# Altium schematic sheet Top_level.SchDoc
size A4
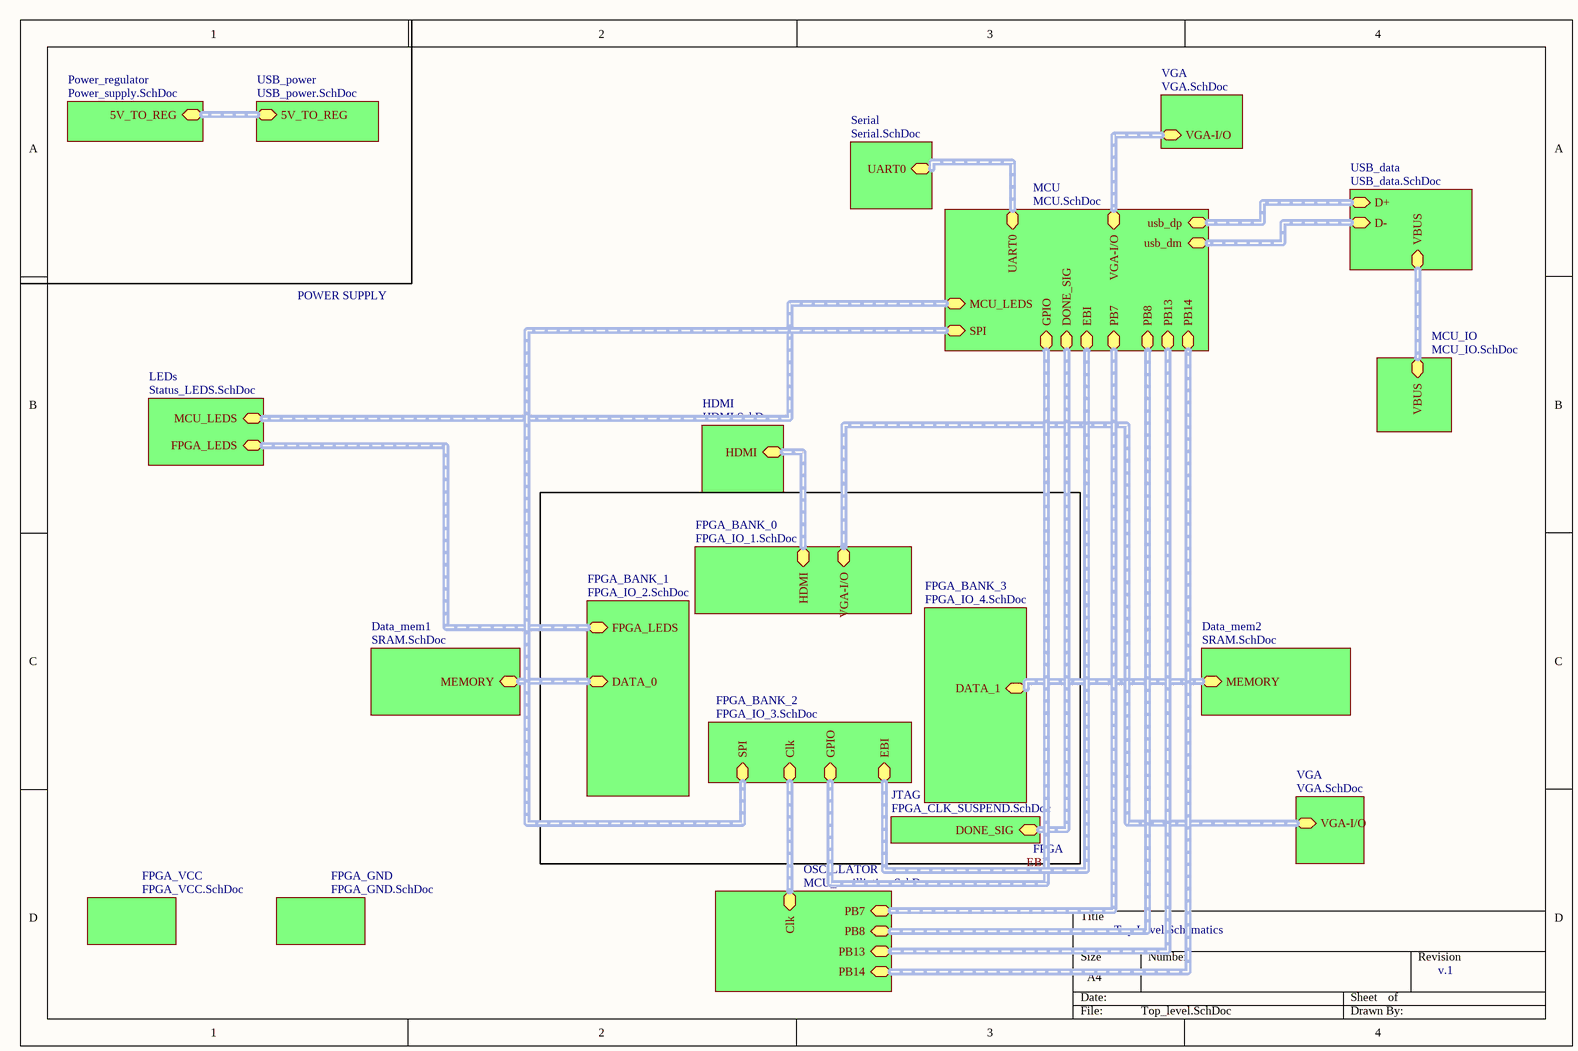
[diagram p0: Top_level.SchDoc]

## Sub-sheets
Data_mem1 = SRAM.SchDoc: MEMORY (harness MEMORY)
Data_mem2 = SRAM.SchDoc: MEMORY (harness MEMORY)
FPGA_BANK_0 = FPGA_IO_1.SchDoc: HDMI (harness HDMI), VGA-I/O (harness VGA-I/O)
FPGA_BANK_1 = FPGA_IO_2.SchDoc: DATA_0 (harness MEMORY), FPGA_LEDS (harness FPGA_LEDS)
FPGA_BANK_2 = FPGA_IO_3.SchDoc: EBI (harness EBI), SPI (harness SPI), Clk (harness FPGA-CLK), GPIO (harness GPIO)
FPGA_BANK_3 = FPGA_IO_4.SchDoc: DATA_1 (harness MEMORY)
FPGA_GND = FPGA_GND.SchDoc: no entries
FPGA_VCC = FPGA_VCC.SchDoc: no entries
HDMI = HDMI.SchDoc: HDMI (harness HDMI)
JTAG = FPGA_CLK_SUSPEND.SchDoc: DONE_SIG (harness DONE_SGN)
LEDs = Status_LEDS.SchDoc: MCU_LEDS (harness MCU_LEDS), FPGA_LEDS (harness FPGA_LEDS)
MCU = MCU.SchDoc: EBI (harness EBI), usb_dp (harness D+), VGA-I/O (harness VGA-I/O), usb_dm (harness D-), MCU_LEDS (harness MCU_LEDS), SPI (harness SPI), PB7 (harness PB7), PB8 (harness PB8), PB13 (harness CLK_signal), PB14 (harness CLK_signal), UART0 (harness UART0), DONE_SIG (harness DONE_SGN), GPIO (harness GPIO)
MCU_IO = MCU_IO.SchDoc: VBUS (harness VBUS)
OSCILLATOR = MCU_oscilliation.SchDoc: PB7 (harness PB7), PB13 (harness CLK_signal), PB14 (harness CLK_signal), PB8 (harness PB8), Clk (harness FPGA-CLK)
Power_regulator = Power_supply.SchDoc: 5V_TO_REG (harness 5V_TO_REG)
Serial = Serial.SchDoc: UART0 (harness UART0)
USB_data = USB_data.SchDoc: D+ (harness D+), D- (harness D-), VBUS (harness VBUS)
USB_power = USB_power.SchDoc: 5V_TO_REG (harness 5V_TO_REG)
VGA = VGA.SchDoc: VGA-I/O (harness VGA-I/O)
VGA = VGA.SchDoc: VGA-I/O (harness VGA-I/O)

## Buses and harness runs
harness EBI = sheet FPGA_BANK_2/EBI = sheet MCU/EBI
harness sheet Data_mem1/MEMORY = sheet FPGA_BANK_1/DATA_0
harness sheet Data_mem2/MEMORY = sheet FPGA_BANK_3/DATA_1
harness sheet FPGA_BANK_0/HDMI = sheet HDMI/HDMI
harness sheet FPGA_BANK_0/VGA-I/O = sheet VGA/VGA-I/O
harness sheet FPGA_BANK_1/FPGA_LEDS = sheet LEDs/FPGA_LEDS
harness sheet FPGA_BANK_2/Clk = sheet OSCILLATOR/Clk
harness sheet FPGA_BANK_2/GPIO = sheet MCU/GPIO
harness sheet FPGA_BANK_2/SPI = sheet MCU/SPI
harness sheet JTAG/DONE_SIG = sheet MCU/DONE_SIG
harness sheet LEDs/MCU_LEDS = sheet MCU/MCU_LEDS
harness sheet MCU/PB7 = sheet OSCILLATOR/PB7
harness sheet MCU/PB8 = sheet OSCILLATOR/PB8
harness sheet MCU/PB13 = sheet OSCILLATOR/PB13
harness sheet MCU/PB14 = sheet OSCILLATOR/PB14
harness sheet MCU/UART0 = sheet Serial/UART0
harness sheet MCU/usb_dm = sheet USB_data/D-
harness sheet MCU/usb_dp = sheet USB_data/D+
harness sheet MCU/VGA-I/O = sheet VGA/VGA-I/O
harness sheet MCU_IO/VBUS = sheet USB_data/VBUS
harness sheet Power_regulator/5V_TO_REG = sheet USB_power/5V_TO_REG

## Notes on the sheet
- POWER SUPPLY
- FPGA
- Top Level Schematics
- v.1